# Altium schematic sheet VGA.SchDoc
size A4
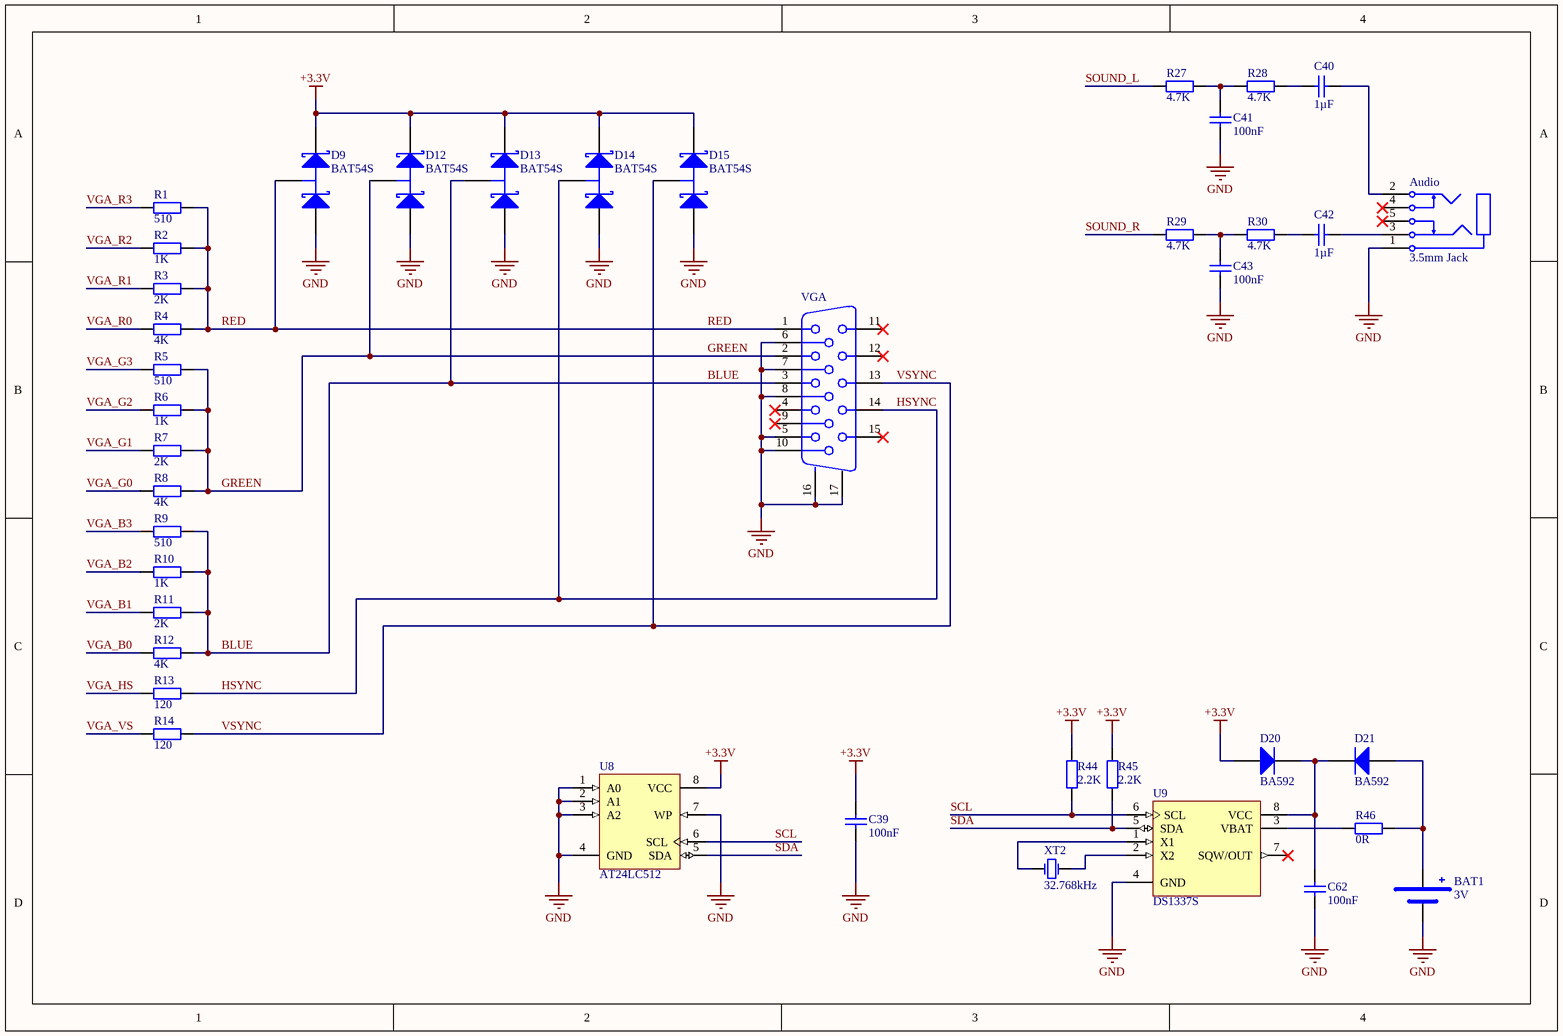
[diagram p0: VGA.SchDoc]

## Parts
Audio  3.5mm Jack  [SJ1-353XNG]
BAT1  3V  [CR2032 HOLDER - Vertical]
C39  value 100nF  [RESC2012N]  (hidden comment: Capacitor)
C40  value 1µF  [6-0805_n]  (hidden comment: Cap)
C41  value 100nF  [6-0805_n]  (hidden comment: Cap)
C42  value 1µF  [6-0805_n]  (hidden comment: Cap)
C43  value 100nF  [6-0805_n]  (hidden comment: Cap)
C62  value 100nF  [RESC2012N]  (hidden comment: Capacitor)
D9  BAT54S  [SOT23_N]
D12  BAT54S  [SOT23_N]
D13  BAT54S  [SOT23_N]
D14  BAT54S  [SOT23_N]
D15  BAT54S  [SOT23_N]
D20  BA592  [SOD-323]
D21  BA592  [SOD-323]
R1  value 510  [6-0805_N]  (hidden comment: Res2)
R2  value 1K  [6-0805_N]  (hidden comment: Res2)
R3  value 2K  [6-0805_N]  (hidden comment: Res2)
R4  value 4K  [6-0805_N]  (hidden comment: Res2)
R5  value 510  [6-0805_N]  (hidden comment: Res2)
R6  value 1K  [6-0805_N]  (hidden comment: Res2)
R7  value 2K  [6-0805_N]  (hidden comment: Res2)
R8  value 4K  [6-0805_N]  (hidden comment: Res2)
R9  value 510  [6-0805_N]  (hidden comment: Res2)
R10  value 1K  [6-0805_N]  (hidden comment: Res2)
R11  value 2K  [6-0805_N]  (hidden comment: Res2)
R12  value 4K  [6-0805_N]  (hidden comment: Res2)
R13  value 120  [6-0805_N]  (hidden comment: Res2)
R14  value 120  [6-0805_N]  (hidden comment: Res2)
R27  value 4.7K  [6-0805_N]  (hidden comment: Res2)
R28  value 4.7K  [6-0805_N]  (hidden comment: Res2)
R29  value 4.7K  [6-0805_N]  (hidden comment: Res2)
R30  value 4.7K  [6-0805_N]  (hidden comment: Res2)
R44  value 2.2K  [RESC2012N]  (hidden comment: Resistor)
R45  value 2.2K  [RESC2012N]  (hidden comment: Resistor)
R46  value 0R  [RESC2012N]  (hidden comment: Resistor)
U8  AT24LC512  [8S1_N]
U9  DS1337S  [SOIC8N_N]
VGA  Video  [VGA Connector]  (value not drawn)
XT2  value 32.768kHz  [SMD Clock Quarz]  (hidden comment: XTAL)

## Nets
+3.3V: C39.1 D9.2(K) D12.2(K) D13.2(K) D14.2(K) D15.2(K) D20.2(A) R44.2 R45.2 U8.8(VCC)
GND: Audio.1 BAT1.2 C39.2 C41.1 C43.1 C62.2 D9.1(A) D12.1(A) D13.1(A) D14.1(A) D15.1(A) U8.1(A0) U8.2(A1) U8.3(A2) U8.4(GND) U8.7(WP) U9.4(GND) VGA.5 VGA.6 VGA.7 VGA.8 VGA.10 VGA.16(MH1) VGA.17(MH2)
BLUE: D13.3(C) R9.1 R10.1 R11.1 R12.1 VGA.3
GREEN: D12.3(C) R5.1 R6.1 R7.1 R8.1 VGA.2
HSYNC: D14.3(C) R13.1 VGA.14
RED: D9.3(C) R1.1 R2.1 R3.1 R4.1 VGA.1
SCL: R44.1 U8.6(SCL) U9.6(SCL)
SDA: R45.1 U8.5(SDA) U9.5(SDA)
SOUND_L: R27.1
SOUND_R: R29.1
VGA_B0: R12.2
VGA_B1: R11.2
VGA_B2: R10.2
VGA_B3: R9.2
VGA_G0: R8.2
VGA_G1: R7.2
VGA_G2: R6.2
VGA_G3: R5.2
VGA_HS: R13.2
VGA_R0: R4.2
VGA_R1: R3.2
VGA_R2: R2.2
VGA_R3: R1.2
VGA_VS: R14.2
VSYNC: D15.3(C) R14.1 VGA.13
NetAudio_2: Audio.2 C40.1
NetAudio_3: Audio.3 C42.1
NetBAT1_1: BAT1.1 D21.2(A) R46.1
NetC40_2: C40.2 R28.2
NetC41_2: C41.2 R27.2 R28.1
NetC42_2: C42.2 R30.1
NetC43_2: C43.2 R29.2 R30.2
NetC62_1: C62.1 D20.1(K) D21.1(K) U9.8(VCC)
NetR46_2: R46.2 U9.3(VBAT)
NetU9_1: U9.1(X1) XT2.1(OSC1)
NetU9_2: U9.2(X2) XT2.2(OSC2)

Not connected (* = marked no-connect by the designer): Audio 4* 5*; U9 7(SQW/OUT)*; VGA 4* 9* 11* 12* 15*

## Notes on the sheet
- Title
- Size:
- Date:
- A4
- Number:
- Time:
- Revision:
- Sheet
- of
- File:

## Library data of the parts
Audio = Phono Jack
BAT1 = CR2032 Battery
C40-C43 = Cap: Capacitor; Published: 8-Jun-2000; LatestRevisionDate: 17-Jul-2002; LatestRevisionNote: Re-released for DXP Platform.; PackageReference: RAD-0.3; Publisher: Altium Limited; PackageDescription: Radial Cap, Thru-Hole; 2 Leads; 0.3 in Pin Spacing
D9 D12-D15 = BAT54S: Schottky Barrier Double Diode; Published: 17-Sep-2003; LatestRevisionDate: 12-Dec-2006; LatestRevisionNote: IPC-7351 Footprint Added.; DatasheetVersion: 4-Mar-2002; PackageVersion: May-1999; PackageReference: SOT23; Publisher: Altium Limited; PackageDescription: 3-Pin SOT-23 Package 0.95 mm Pitch, 2.3 mm Lead Span; ComponentLink1Description: Manufacturer Link; ComponentLink1URL: http://www.semiconductors.philips.com/; ComponentLink2Description: Datasheet; ComponentLink2URL: http://www.semiconductors.philips.com/acrobat/datasheets/BAT54_SERIES_4.pdf
D20 D21 = BA592: Silicon RF Switching Diode for VHF Band Switching in TV/VTR Tuners; Published: 21-Mar-2003; LatestRevisionDate: 19-Mar-2004; LatestRevisionNote: Silkscreen size reduced.; DatasheetDocument: Oct-1999; PackageDocument: Sep-2000; PackageReference: SOD-323; Publisher: Altium Limited; ComponentLink1Description: Manufacturer Link; ComponentLink1URL: http://www.infineon.com/; ComponentLink2Description: Datasheet; ComponentLink2URL: http://www.infineon.com/upload/Document/cmc_upload/documents/080/120/ba592_ba892series_1.pdf
R1-R14 R27-R30 = Res2: Resistor; Published: 8-Jun-2000; LatestRevisionDate: 17-Jul-2002; LatestRevisionNote: Re-released for DXP Platform.; PackageReference: AXIAL-0.4; Publisher: Altium Limited; PackageDescription: Axial Device, Thru-Hole; 2 Leads; 0.4 in Pin Spacing
U8 = AT24C01BN-SP25-B: 1Kbit (128 x 8), 2-wire Bus Automotive Serial EEPROM with Write Protect, 2.5V, 8-Pin SOIC, Bulk; Published: 20-Sep-2010; DatasheetVersion: 8517C,  Jan-2009; PackageVersion: revC, Mar-2005; PackageReference: 8S1; Publisher: Altium Limited; PackageDescription: 8-Lead (0.150" Wide Body), Plastic Gull Wing Small Outline (JEDEC SOIC); Code_JEDEC: MS-012-AA; Code_IPC: SOIC127P600-8; ComponentLink1Description: Manufacturer Link; ComponentLink1URL: http://www.atmel.com/products/serial/default.asp; ComponentLink2Description: Datasheet; ComponentLink2URL: http://www.atmel.com/dyn/resources/prod_documents/doc8517.pdf; ComponentLink3Description: Atmel.com Home; ComponentLink3URL: http://www.atmel.com
U9 = DS1307Z: 64 X 8 Serial Real-Time Clock; Published: 13-Oct-2000; LatestRevisionDate: 13-Apr-2006; LatestRevisionNote: IPC-7351 Footprint Added.; DatasheetVersion: 10-Aug-1999; PackageVersion: 1999; PackageReference: SOIC8N; Publisher: Altium Limited; PackageDescription: 8-Pin Small Outline Integrated Circuit 1.27 mm Pitch; Code_IPC: SOIC127P600-8; ComponentLink1Description: Manufacturer Link; ComponentLink1URL: http://www.maxim-ic.com/; ComponentLink2Description: Datasheet; ComponentLink2URL: http://pdfserv.maxim-ic.com/en/ds/DS1307.pdf; ComponentLink3Description: Discontinuation Notice; ComponentLink3URL: http://www.maxim-ic.com/qa/pdfs/non-obsolescence-letter.pdf
VGA = VGA Connector
C39 C62 = Capacitor: Published: 8-Jun-2000; LatestRevisionDate: 17-Jul-2002; LatestRevisionNote: Re-released for DXP Platform.; PackageReference: RAD-0.3; Publisher: Altium Limited; PackageDescription: Radial Cap, Thru-Hole; 2 Leads; 0.3 in Pin Spacing
R44-R46 = Resistor: Published: 8-Jun-2000; LatestRevisionDate: 17-Jul-2002; LatestRevisionNote: Re-released for DXP Platform.; PackageReference: AXIAL-0.4; Publisher: Altium Limited; PackageDescription: Axial Device, Thru-Hole; 2 Leads; 0.4 in Pin Spacing